# Altium project Gateway v1.6.PrjPcb
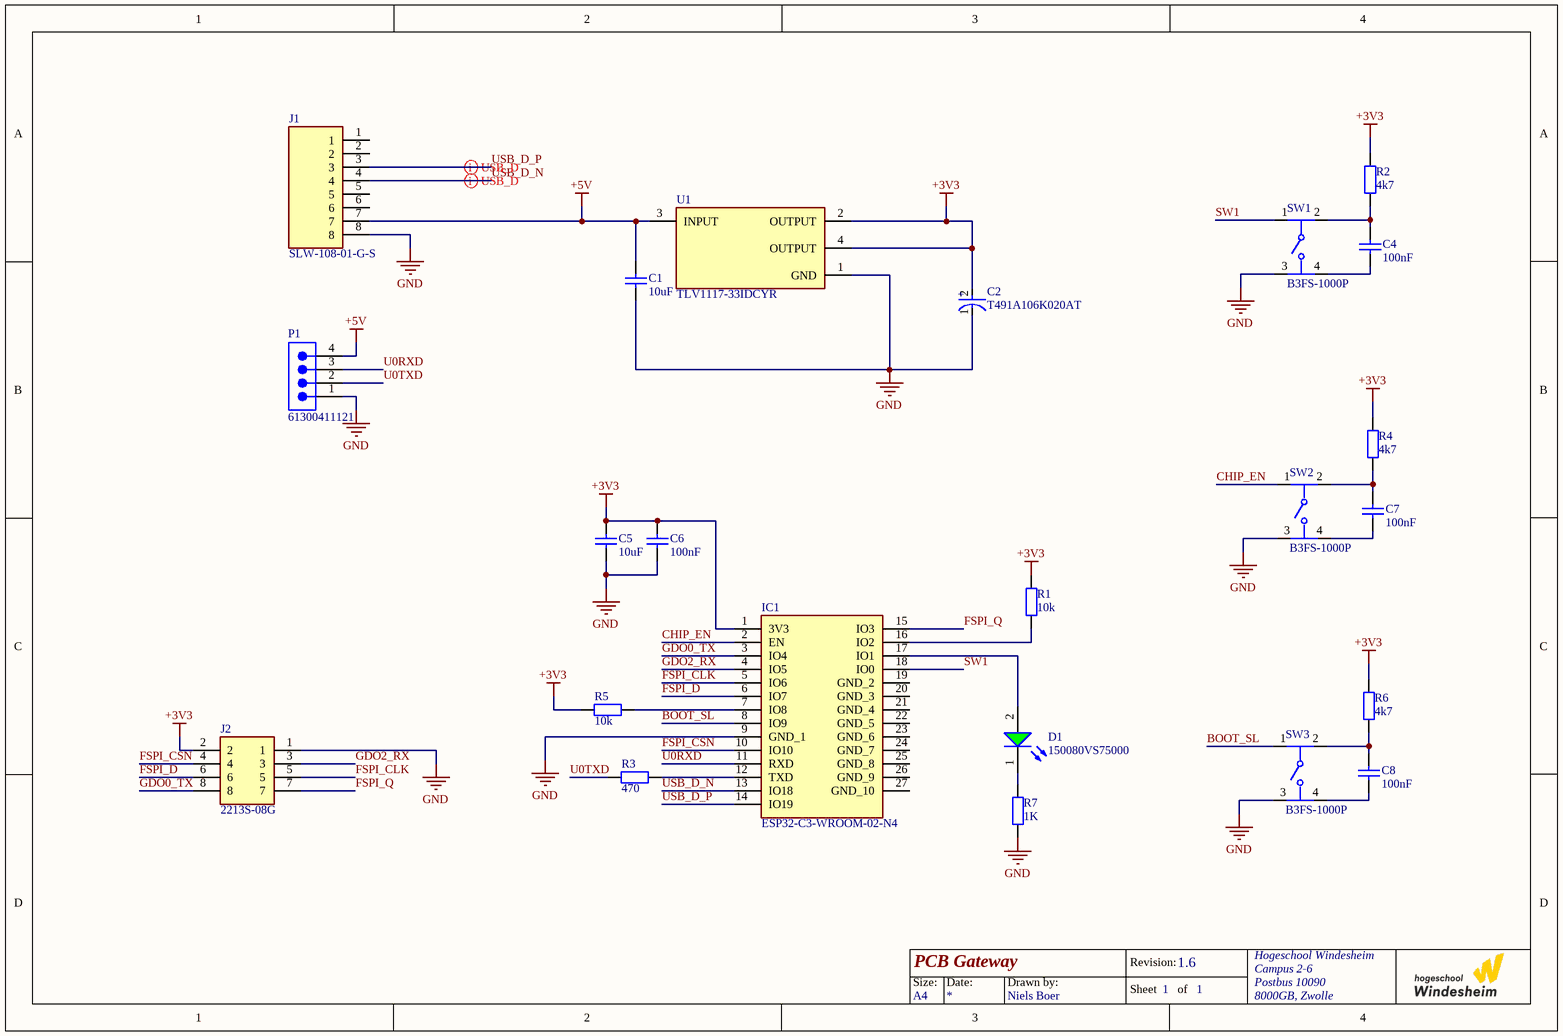
[diagram p0: Main.SchDoc]
1 sheet, 23 parts. Net scope: global (net labels, ports and power ports of the same name join across sheets).
Board file: PCB1.PcbDoc

## Sheet Main.SchDoc: PCB Gateway
size A4; DrawnBy: Niels Boer; Revision: 1.6; SheetNumber: 1; SheetTotal: 1; SPICEModelCacheLWGWPIKD: <root> / <DocumentId>LWGWPIKD</DocumentId> / </root>

### Parts
C1  10uF  [C1206]
C2  T491A106K020AT  [FP-T491A106K020AT-MFG]
C4  100nF  [C1206]
C5  10uF  [C1206]
C6  100nF  [C1206]
C7  100nF  [C1206]
C8  100nF  [C1206]
D1  150080VS75000  [WL-SMCW_0805_150080xx75000]
IC1  ESP32-C3-WROOM-02-N4  [ESP32C3WROOM02N4]
J1  SLW-108-01-G-S  [RHDR8W64P0X254_1X8_2032X254X457P]
J2  2213S-08G  [HDRV8W64P254_2X4_1016X508X874P]
P1  61300411121  [61300411121]
R1  10k  [R1206]
R2  4k7  [R1206]
R3  470  [R1206]
R4  4k7  [R1206]
R5  10k  [R1206]
R6  4k7  [R1206]
R7  1K  [R1206]
SW1  B3FS-1000P  [FP-B3FS-1000P-MFG]
SW2  B3FS-1000P  [FP-B3FS-1000P-MFG]
SW3  B3FS-1000P  [FP-B3FS-1000P-MFG]
U1  TLV1117-33IDCYR  [FP-DCY0004A-MFG]

### Nets
+3V3: C2.2(A) C5.2 C6.2 IC1.1(3V3) J2.2 R1.2 R2.2 R4.2 R5.1 R6.2 U1.2(OUTPUT) U1.4(OUTPUT)
+5V: C1.2 J1.7 P1.4 U1.3(INPUT)
GND: C1.1 C2.1(C) C5.1 C6.1 IC1.9(GND_1) J1.8 J2.1 P1.1 R7.1 SW1.3 SW2.3 SW3.3 U1.1(GND)
BOOT_SL: IC1.8(IO9) SW3.1
CHIP_EN: IC1.2(EN) SW2.1
FSPI_CLK: IC1.5(IO6) J2.5
FSPI_CSN: IC1.10(IO10) J2.4
FSPI_D: IC1.6(IO7) J2.6
FSPI_Q: IC1.15(IO3) J2.7
GDO0_TX: IC1.3(IO4) J2.8
GDO2_RX: IC1.4(IO5) J2.3
SW1: IC1.18(IO0) SW1.1
U0RXD: IC1.11(RXD) P1.3
U0TXD: P1.2 R3.1
USB_D_N: IC1.13(IO18) J1.4
USB_D_P: IC1.14(IO19) J1.3
NetC4_1: C4.1 SW1.4
NetC4_2: C4.2 R2.1 SW1.2
NetC7_1: C7.1 SW2.4
NetC7_2: C7.2 R4.1 SW2.2
NetC8_1: C8.1 SW3.4
NetC8_2: C8.2 R6.1 SW3.2
NetD1_1: D1.1(K) R7.2
NetD1_2: D1.2(A) IC1.17(IO1)
NetIC1_7: IC1.7(IO8) R5.2
NetIC1_12: IC1.12(TXD) R3.2
NetIC1_16: IC1.16(IO2) R1.1

Not connected (* = marked no-connect by the designer): IC1 19(GND_2) 20(GND_3) 21(GND_4) 22(GND_5) 23(GND_6) 24(GND_7) 25(GND_8) 26(GND_9) 27(GND_10); J1 1 2 5 6

### Layout directives
differential pair: USB_D_N, USB_D_P

### Notes on the sheet
- Size:
- Date:
- Drawn by:
- Revision:
- Hogeschool Windesheim
- Campus 2-6
- Postbus 10090
- A4
- Sheet
- of
- 8000GB, Zwolle
- (in symbol CMP-03017-000050-1) +

### Library data of the parts
C1 C4-C8 = Capacitor_1206: SMD Capacitor 1206; Published: 03-11-2016; LatestRevisionDate: 03-11-2016; LatestRevisionNote: Creation; PackageReference: C1206; Publisher: Windesheim; PackageDescription: Chip Capacitor, Body 3.2x1.6mm, Height 1.7mm, IPC Medium Density
  C1 C5: Value: 10uF
  C4 C6-C8: Value: 100nF
C2 = CMP-03017-000050-1: CAP TANT 10UF 10% 20V 1206; Capacitance: 1E-05F; Tolerance: 10%; Height: 1.6mm; Case/Package: 3216-18; Lead Free: Lead Free; Length: 3.2mm; RoHS Compliant: Yes; Width: 1.6mm
D1 = CMP-1426-00009-5: NexarPartId: 29717783; Color: Green; Dominant Wavelength: 570nm; Lens Style: Clear, Rectangular; Test Current: 20mA; Max Junction Temperature (Tj): 95°C; Max Reverse Voltage (DC): 5V; Forward Voltage: 2V; Forward Current: 100mA; Viewing Angle: 140°; Power Dissipation: 72mW; Peak Wavelength: 572nm; Luminous Intensity: 40mcd; Max Operating Temperature: 85°C; Case/Package: 0805; Case Code (Metric): 2012; RoHS: Compliant; Packaging: Tape and Reel; Min Operating Temperature: -40°C; Width: 1.25mm; Wavelength: 570nm; Mount: Surface Mount; Length: 2mm; REACH SVHC: Unknown; Height: 700µm; Case Code (Imperial): 0805; Reverse Voltage: 5V
IC1 = ESP32-C3-WROOM-02-N4: Integrated Circuit; Manufacturer_Name: Espressif Systems; Datasheet Link: https://www.mouser.ch/datasheet/2/891/Espressif_ESP32_C3_WROOM_02-2006871.pdf; Height: 3.35mm; Manufacturer_Part_Number: ESP32-C3-WROOM-02-N4; Mouser Part Number: 356-ESP32C3WROOM02N4; Mouser Price/Stock: https://www.mouser.co.uk/ProductDetail/Espressif-Systems/ESP32-C3-WROOM-02-N4?qs=stqOd1AaK7%2FqjTZKEOgfUg%3D%3D
J1 = SLW-108-01-G-S: Connector; Manufacturer_Name: SAMTEC; Datasheet Link: http://suddendocs.samtec.com/prints/slw-1xx-01-x-x-mkt.pdf; Height: 4.57mm; Manufacturer_Part_Number: SLW-108-01-G-S; Mouser Part Number: 200-SLW10801GS; Mouser Price/Stock: https://www.mouser.com/Search/Refine.aspx?Keyword=200-SLW10801GS; Arrow Part Number: SLW-108-01-G-S; Arrow Price/Stock: https://www.arrow.com/en/products/slw-108-01-g-s/samtec
J2 = 2213S-08G: Connector; Manufacturer_Name: MULTICOMP; Datasheet Link: http://www.farnell.com/datasheets/1697533.pdf; Height: 8.74mm; Manufacturer_Part_Number: 2213S-08G
P1 = CMP-1502-01064-2: NexarPartId: 32855522; Pitch: 2.54mm; Number of Contacts: 4; Contact Resistance: 20mΩ; Gender: Male; Current Rating: 3A; Connector Type: Male Pin; Voltage Rating: 250V; Lead Free: Lead Free; Contact Plating: Gold; Max Operating Temperature: 105°C; Packaging: Bulk; Height: 8.89mm; Orientation: Vertical; Contact Mating Length: 5.9944mm; Contact Material: Copper; Lead Pitch: 2.54mm; Min Operating Temperature: -40°C; Termination: Solder; Color: Black; Number of Rows: 1; REACH SVHC: Unknown; RoHS: Compliant; Mount: Through Hole; Number of Positions: 4; Number of Pins: 4; Operating Supply Voltage: 250V
R1-R7 = Resistor_1206: SMD Resistor 1206; Published: 03-11-2016; LatestRevisionDate: 03-11-2016; LatestRevisionNote: Creation; PackageReference: R1206; Publisher: Windesheim; PackageDescription: Chip Resistor, Body 3.2x1.6mm, IPC Medium Density
  R1 R5: Value: 10k
  R2 R4 R6: Value: 4k7
  R3: Value: 470
  R7: Value: 1K
SW1-SW3 = CMP-08834-000003-2: SWITCH TACTILE SPST-NO 0.05A 24V; Switch Function: Off-Mom; Max Current Rating: 50mA; Throw Configuration: SPST; Switch Travel: 0.25mm; Number of Poles: 1; Actuator Length: 0.5mm; Ratings: IP00; Mechanical Life: 1000000Cycles; Illumination Type: Non-Illuminated; Actuator Color: Black; Operating Force: 0.98N; Contact Resistance: 100mR; Actuator Type: Standard; Material: Plastic; Min Operating Temperature: -25°C; Length: 6.3mm; Contact Plating: Silver; Series: B3FS; Max Operating Temperature: 70°C; Contact Material: Silver; Current Rating: 50mA; Depth: 8mm; Mount: Surface Mount; Package Quantity: 1; Max Voltage Rating (DC): 24V; Case/Package: SMD/SMT; Packaging: Tape and Reel; Orientation: Straight; Weight: 0.2g; Electrical Life: 1000000Cycles; Contact Current Rating: 50mA; Lead Free: Lead Free; Termination: Gull Wing; Voltage Rating (DC): 24V
U1 = CMP-04917-000056-1: IC REG LIN 3.3V 800MA SOT223-4; Manufacturer: Texas Instruments; Nominal Supply Current: 5mA; Dropout Voltage: 1.2V; Max Supply Voltage: 15V; Min Supply Voltage: 4.7V; Output Type: Fixed; Number Of Outputs: 1; Output Current: 0.8A; Standoff Height: 0.02mm; Max Junction Temp: +125°C; Lead Free: Yes; RoHS: TRUE; Temperature: -40°C to +125°C; Device Class L1: Integrated Circuits (ICs); Output Voltage: 3.3V; Device Class L3: Voltage Regulators - Linear; Octopart: https://octopart.com/tlv1117-33idcyr-texas+instruments-669250; Device Class L2: Power Management ICs; Package: DCY0004A; Temperature Range High: +125°C; Category: IC; Height: 1.8mm; Automotive: No; Digikey Description: IC REG LIN 3.3V 800MA SOT223-4; Temperature Range Low: -40°C; ComponentLink2URL: http://www.ti.com/lit/ds/symlink/tlv1117.pdf; ComponentLink2Description: Datasheet; Manufacturer Part Number: TLV1117-33IDCYR; Mouser Description: LDO Voltage Regulators Fixed LDO Volt Reg